# EAGLE schematic SmartThermo1 (EAGLE 8.4.0)
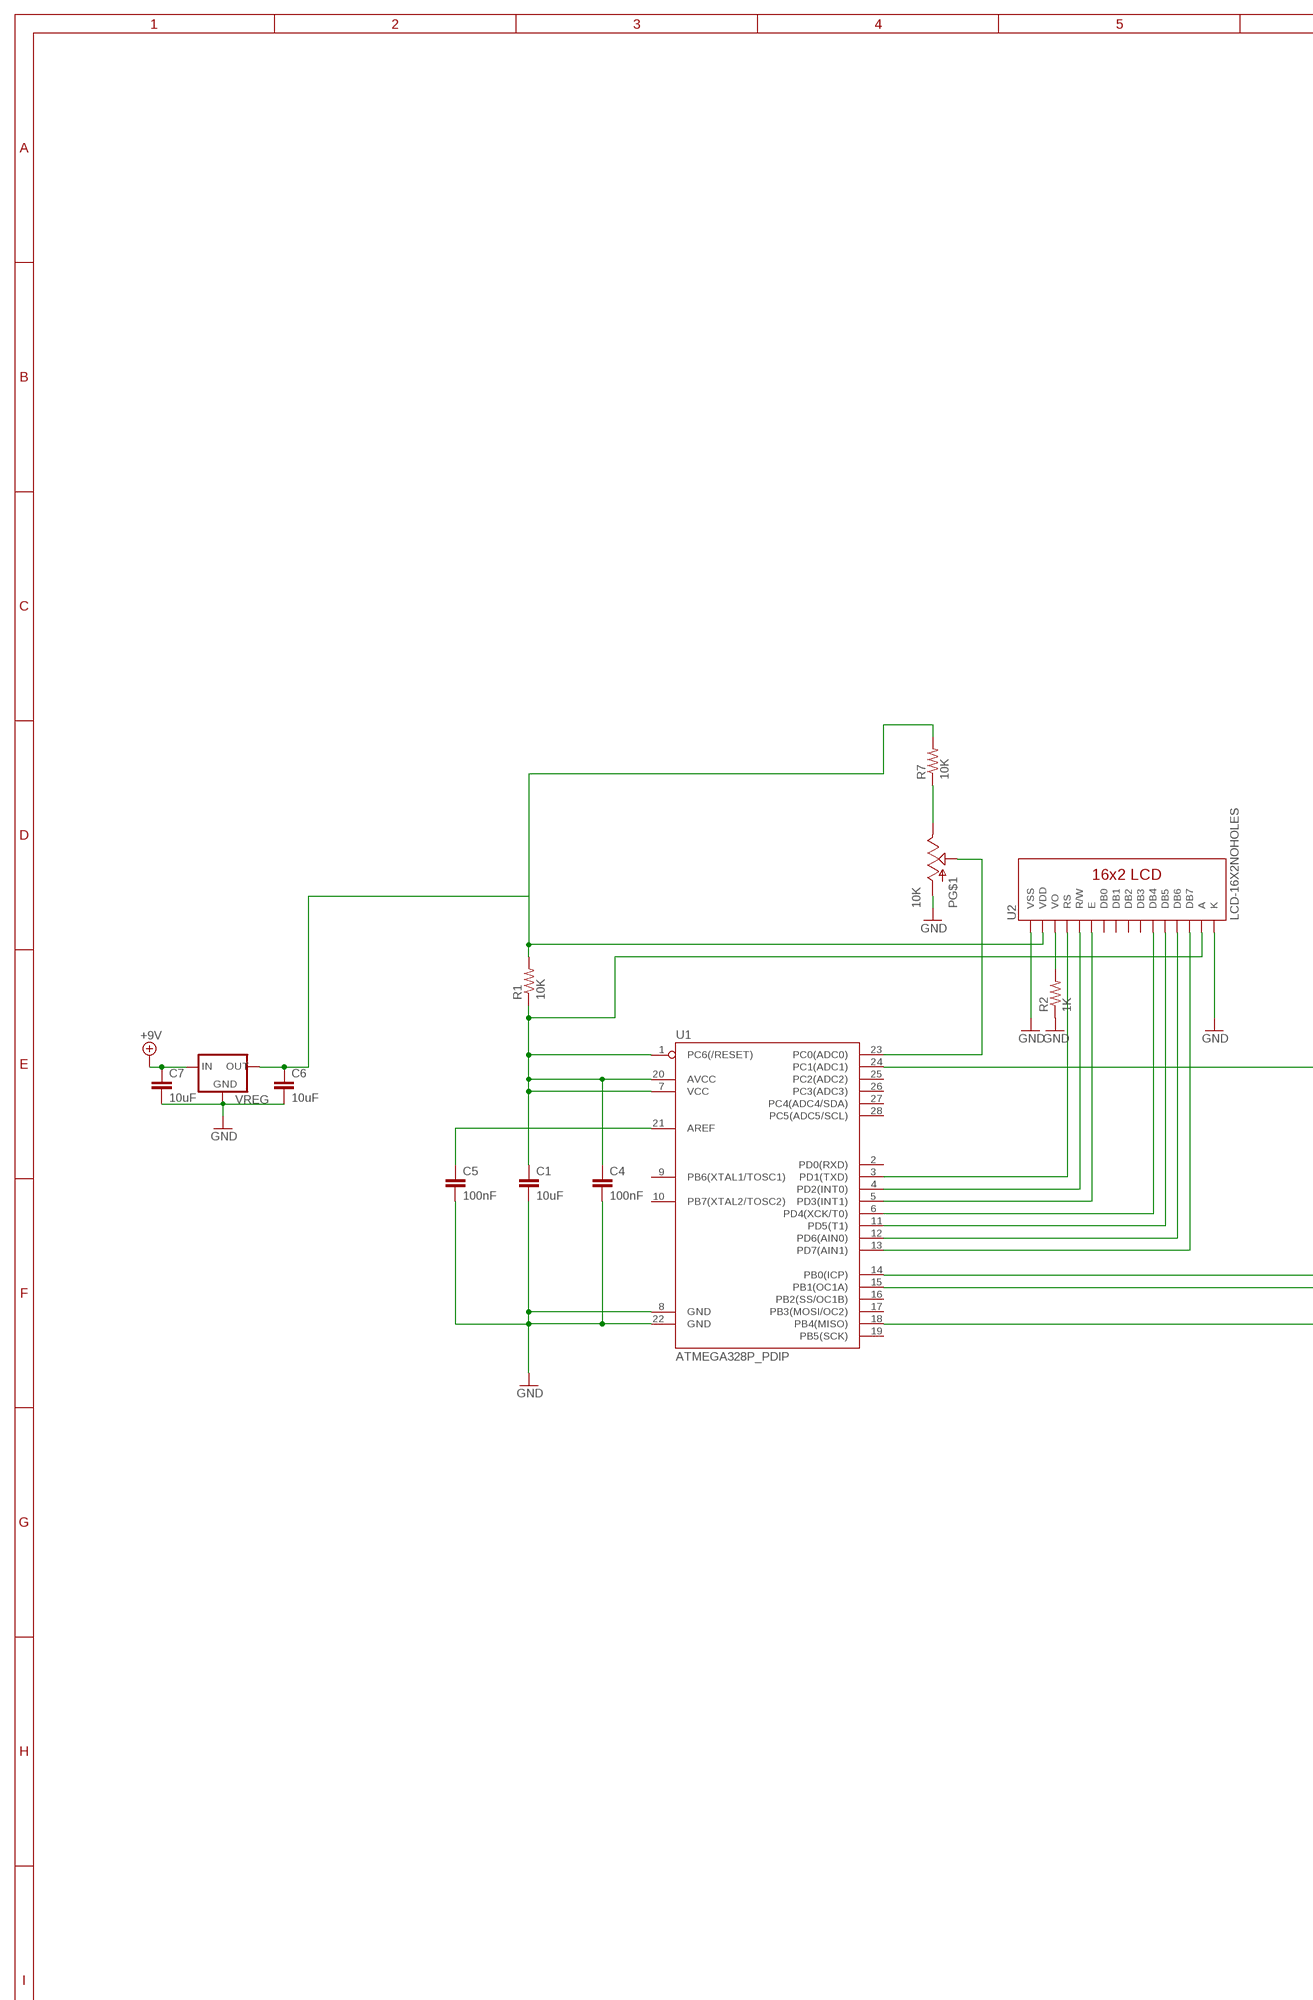
[diagram p0: schematic, sheet 1, part 1 of 2]
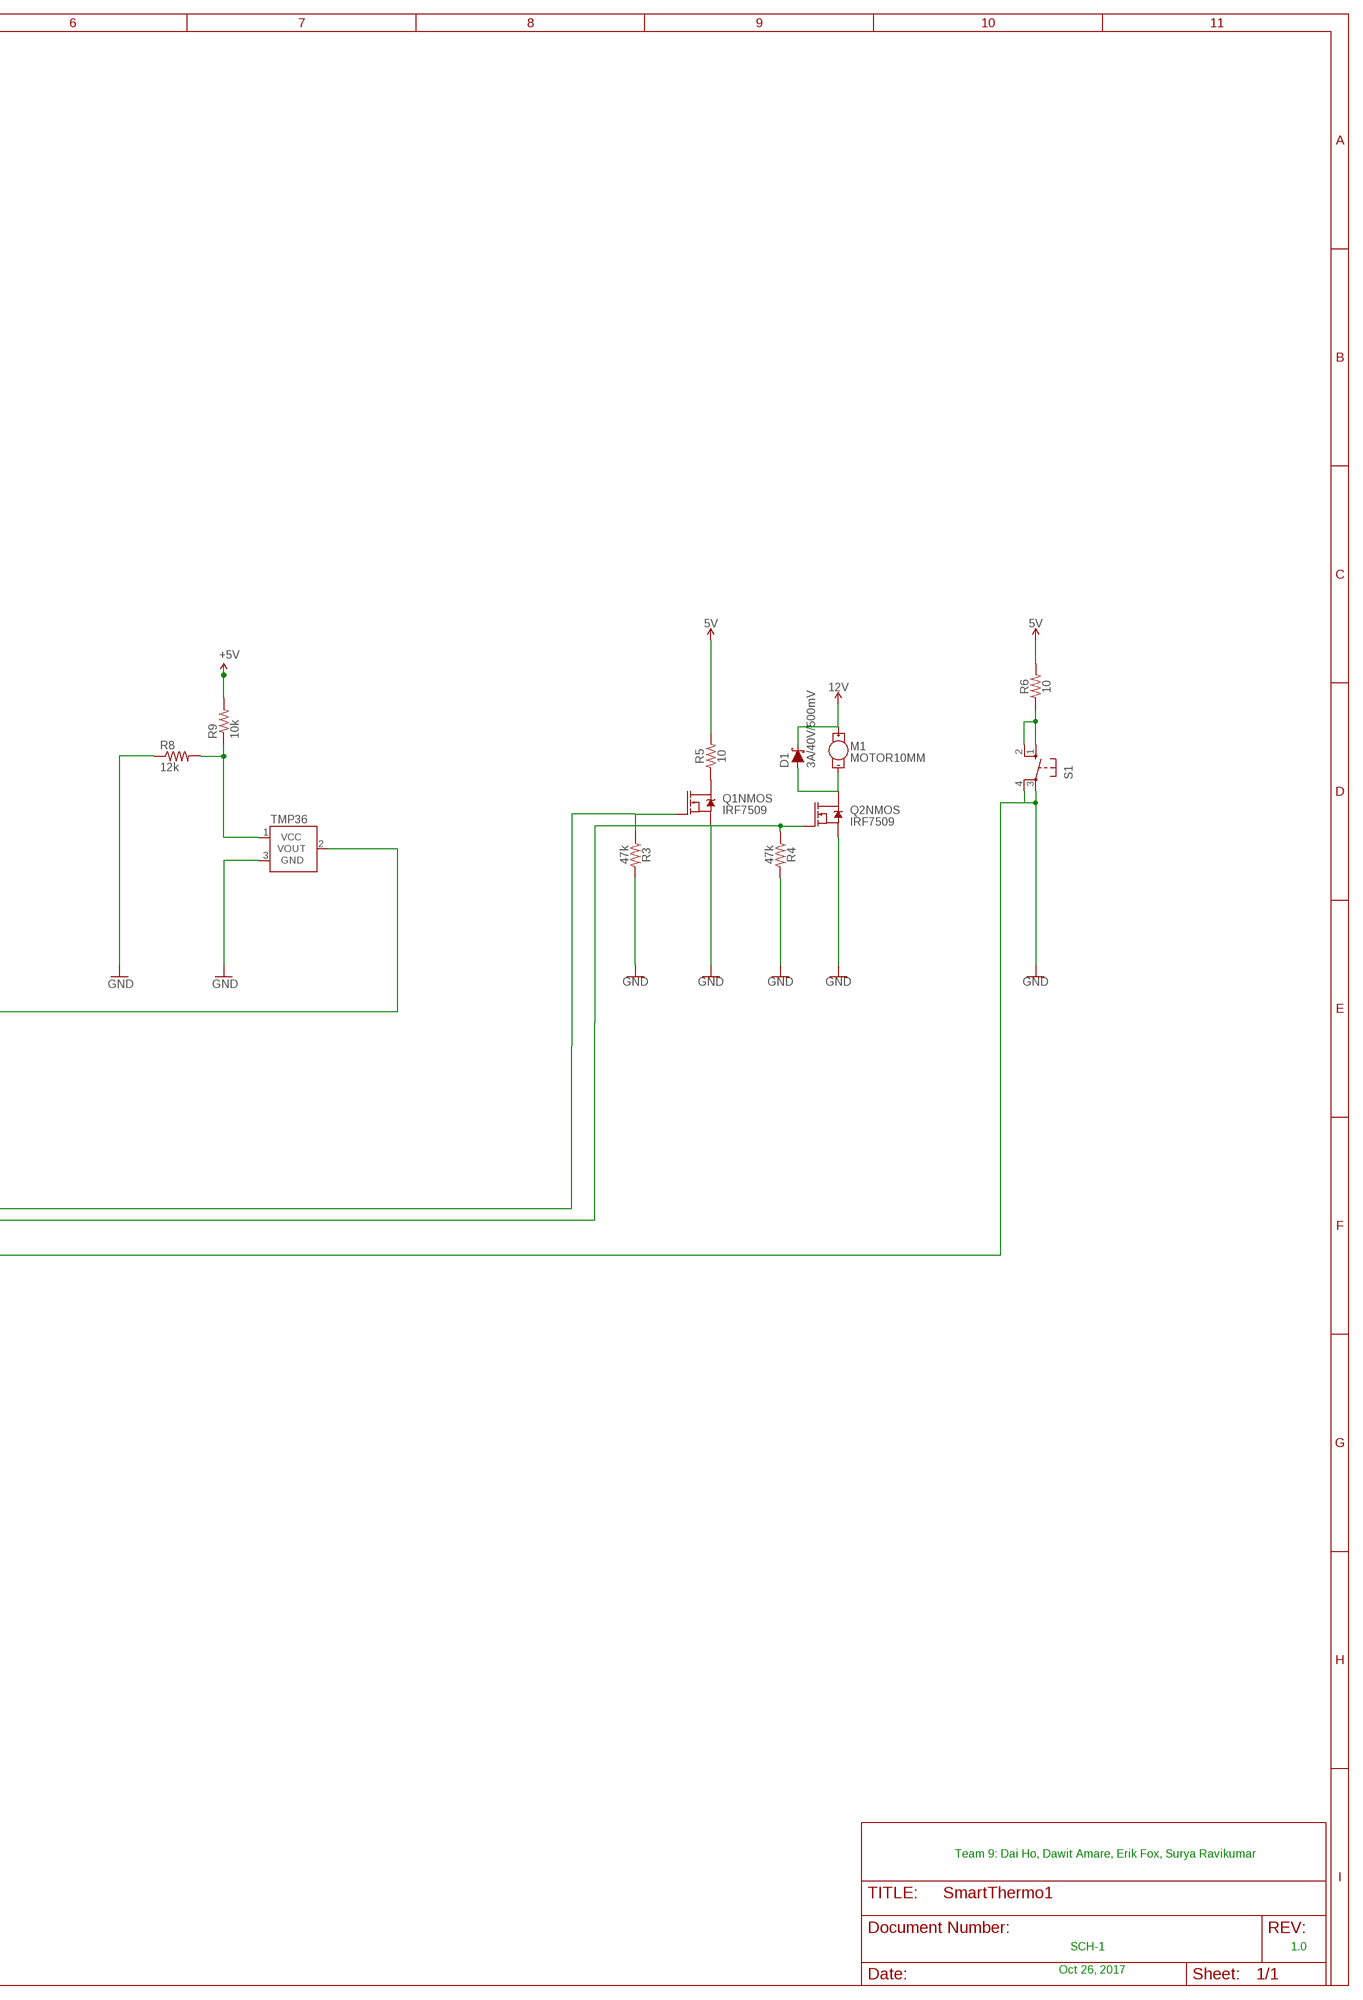
[diagram p1: schematic, sheet 1, part 2 of 2]

## Parts
C1  10uF  10UF-6.3V-20%(1206)  [1206]
C4  100nF  C2.5/2  [C2.5-2]
C5  100nF  C2.5/2  [C2.5-2]
C6  10uF  10UF-1206-6.3V-20%  [1206]
C7  10uF  10UF-1206-6.3V-20%  [1206]
D1  3A/40V/500mV  DIODE-SCHOTTKY-B340A  [SMA-DIODE]
M1  MOTOR10MM  [VIBE-MOTOR-10MM]
P  10K  POT_SWITCHPOT_PTH  [POT_PTH]
Q1  IRF7509  [MSOP8]
Q2  IRF7509  [MSOP8]
R1  10K  RESISTOR1206  [1206]
R2  1K  1KOHM1/10W1%(0603)  [0603-RES]
R3  47k  47KOHM-0603-1/10W-1%  [0603]
R4  47k  47KOHM-0603-1/10W-1%  [0603]
R5  10  10OHM-0603-1/10W-5%  [0603]
R6  10  10OHM-0603-1/10W-5%  [0603]
R7  10K  RESISTOR1206  [1206]
R8  12k  R-US_0207/5V  [0207/5V]
R9  10k  R-US_0207/5V  [0207/5V]
S1  10-XX  [B3F-10XX]
TMP36  TMP36GT9  [TO-92]
U1  ATMEGA328P_PDIP  [DIL28-3]
U2  LCD-16X2NOHOLES  [LCD-16X2_NOHOLES]
VREG  V_REG_78XX-TO-220  [TO-220-ALT]

## Nets
5V: R5.2 R6.2
12V: D1.C M1.+
+9V: C7.1 VREG.IN
GND: C1.2 C4.2 C5.2 C6.2 C7.2 P.E@1(A) Q1.1(NMOS:S) Q2.1(NMOS:S) R2.1 R3.2 R4.2 R8.1 S1.3(P) S1.4(P1) TMP36.3(GND) U1.8(GND) U1.18(PB4(MISO)) U1.22(GND) U2.1(VSS) U2.16(K) VREG.GND
N$1: C1.1 C4.1 R1.1 U1.1(PC6(/RESET)) U1.7(VCC) U1.20(AVCC) U2.15(A)
N$2: TMP36.2(VOUT) U1.24(PC1(ADC1))
N$3: Q1.2(NMOS:G) R3.1 U1.14(PB0(ICP))
N$4: Q2.2(NMOS:G) R4.1 U1.15(PB1(OC1A))
N$5: U1.3(PD1(TXD)) U2.4(RS)
N$6: U1.4(PD2(INT0)) U2.5(R/W)
N$7: U1.5(PD3(INT1)) U2.6(E)
N$8: U1.6(PD4(XCK/T0)) U2.11(DB4)
N$9: U1.11(PD5(T1)) U2.12(DB5)
N$10: U1.12(PD6(AIN0)) U2.13(DB6)
N$11: U1.13(PD7(AIN1)) U2.14(DB7)
N$12: R8.2 R9.1 TMP36.1(VCC)
N$13: D1.A M1.- Q2.7(NMOS:D) Q2.8(NMOS:D)
N$14: Q1.7(NMOS:D) Q1.8(NMOS:D) R5.1
N$15: R6.1 S1.1(S) S1.2(S1)
N$16: R2.2 U2.3(VO)
N$17: P.E@2(E) R7.1
N$18: P.WAND(S) U1.23(PC0(ADC0))
N$19: C5.1 U1.21(AREF)
N$20: C6.1 R1.2 R7.2 U2.2(VDD) VREG.OUT
VCC: R9.2 ; supply symbol labelled +5V
Unconnected: P.S1 P.S2 Q1.3(PMOS:S) Q1.4(PMOS:G) Q1.5(PMOS:D) Q1.6(PMOS:D) Q2.3(PMOS:S) Q2.4(PMOS:G) Q2.5(PMOS:D) Q2.6(PMOS:D) U1.2(PD0(RXD)) U1.9(PB6(XTAL1/TOSC1)) U1.10(PB7(XTAL2/TOSC2)) U1.16(PB2(SS/OC1B)) U1.17(PB3(MOSI/OC2)) U1.19(PB5(SCK)) U1.25(PC2(ADC2)) U1.26(PC3(ADC3)) U1.27(PC4(ADC4/SDA)) U1.28(PC5(ADC5/SCL)) U2.7(DB0) U2.8(DB1) U2.9(DB2) U2.10(DB3)

## Notes on the sheet
- Team 9: Dai Ho, Dawit Amare, Erik Fox, Surya Ravikumar
- SCH-1 | 1.0
- Oct 26, 2017

## Library data of the parts
C1 = SparkFun-Capacitors:10UF-6.3V-20%(1206): CAP-10057 Ceramic; PROD_ID: CAP-10057
C4 C5 = capacitor-wima:C: CAPACITOR naming: grid - package width
C6 C7 = SparkFun-Capacitors:10UF: 10.0µF ceramic capacitors A capacitor is a passive two-terminal electrical component used to store electrical energy temporarily in an electric field.; PROD_ID: CAP-10057
D1 = SparkFun-DiscreteSemi:DIODE-SCHOTTKY: Schottky diode A Schottky diode is a semiconductor diode which has a low forward voltage drop and a very fast switching action.; PROD_ID: DIO-09886
M1 = SparkFun-Electromechanical:MOTOR: Motor (Single-Phase) Two-terminal, single-phase motors. SparkFun Products Vibration Motor <https://www.sparkfun.com/products/8449> (ROB-08449) Physical dimension and wire connections for this powerful vibration motor. Motor has a self adhesive backing.; PROD_ID: COMP-08572; SF_SKU: ROB-08449
P = button_TestFootprint:POT_SWITCH: Potentiometer w/ switch.
Q1 Q2 = SparkFun-DiscreteSemi:IRF7509: Dual N and P Channel MOSFET Dual N/P-Channel 30V 1.25 W 7.8/7.5 nC Hexfet Power Mosfet Surface Mount-MICRO-8. NMOS RDS(ON) 0.11Ω. PMOS RDS(ON) 0.20Ω. Link to datasheet <http://www.irf.com/product-info/datasheets/data/irf7509pbf.pdf> SparkFun Products: SparkFun RedBot Mainboard <https://www.sparkfun.com/products/12097> SparkFun Wake on Shake <https://www.sparkfun.com/products/11447>; PROD_ID: TRANS-07913
R1 R7 = SparkFun-Passives:RESISTOR: Resistor Basic schematic elements and footprints for 0603, 1206, and PTH resistors.
R2 = SparkFun-Resistors:1KOHM1/10W1%(0603): RES-07856; PROD_ID: RES-07856
R3 R4 = SparkFun-Resistors:47KOHM: 47kΩ resistor A resistor is a passive two-terminal electrical component that implements electrical resistance as a circuit element. Resistors act to reduce current flow, and, at the same time, act to lower voltage levels within circuits. - Wikipedia; PROD_ID: RES-07871
R5 R6 = SparkFun-Resistors:10OHM: 10Ω resistor A resistor is a passive two-terminal electrical component that implements electrical resistance as a circuit element. Resistors act to reduce current flow, and, at the same time, act to lower voltage levels within circuits. - Wikipedia; PROD_ID: RES-09834
R8 R9 = resistor:R-US_: RESISTOR, American symbol
S1 = switch-omron:10-XX: OMRON SWITCH; MPN: B3F-1000; OC_FARNELL: 176432; OC_NEWARK: 36M3542
TMP36 = SparkFun-Sensors:TMP36: Precision degC temp sensor, analog out
U1 = SparkFun-DigitalIC:ATMEGA328P_PDIP: uC used in the Arduino 32kb flash, 1k EEPROM, 2k SRAM This is the through-hole version of this chip.
U2 = SparkFun-Displays:LCD-16X2: Standard text-only 16x2 parallel input LCD
VREG = SparkFun-PowerIC:V_REG_78XX: Voltage Regulator Standard 7805 5V regulator. IGO (Input Ground Output). Spark Fun Electronics SKU : COM-00107